# Altium schematic sheet SPE_router_e-fuse_3A.SchDoc: SPE Router
size 420 x 297 mm; Author: P. Daniel; CompanyName: WUT ISE; DrawnBy: P. Daniel; Organization: WUT ISE; Address1: WUT ISE; Address2: Nowowiejska 15/19 00-665 Warsaw; Address3: piotrmaciejdaniel@gmail.com; Revision: 1; SheetNumber: 3; SheetTotal: 6; ModifiedBy: -; CreateDate: 02-03.2023; CheckedDate: -; Title2: e-fuse 3A; DivGrp: WUT ISE; Designer: Piotr Daniel
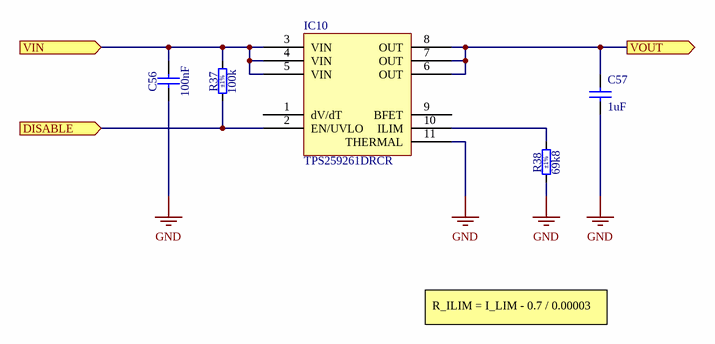
[diagram p0: SPE_router_e-fuse_3A.SchDoc]

## Parts
C56  100nF  [CAPC1005X55N]
C57  1uF  [CAPC1005X55N]
IC10  TPS259261DRCR  [VSON50P300X100_HS-11N]
R37  100k  Tolerance: ±1%  [RESC1005X40N]
R38  69k8  Tolerance: ±1%  [RESC1005X40N]

## Ports
DISABLE (in), VIN (in), VOUT (out)

## Nets
GND: C56.1 C57.1 IC10.11(THERMAL) R38.1
DISABLE: IC10.2(EN/UVLO) R37.1 ; port DISABLE
VIN: C56.2 IC10.3(VIN) IC10.4(VIN) IC10.5(VIN) R37.2 ; port VIN
VOUT: C57.2 IC10.6(OUT) IC10.7(OUT) IC10.8(OUT) ; port VOUT
NetIC10_10: IC10.10(ILIM) R38.2

Not connected (* = marked no-connect by the designer): IC10 1(dV/dT) 9(BFET)

## Notes on the sheet
- R_ILIM = I_LIM - 0.7 / 0.00003
- Project/Equipment
- Document
- Designer
- Drawn by
- Check.by
- Copyright WUT ISE 2021.
  This documentation describes Open Hardware and is licensed under the CERN OHL v.1.1. You may redistribute and modify this documentation under the terms of the CERN OHL v.1.1. (http://ohwr.org/CERNOHL). This documentation is distributed WITHOUT ANY EXPRESS OR IMPLIED WARRANTY, INCLUDING OF MERCHANTABILITY, SATISFACTORY QUALITY AND FITNESS FOR A PARTICULAR PURPOSE. Please see the CERN OHL v.1.1 for applicable conditions.
- Contact
- File
- Last Mod.
- Print Date
- Sheet
- Size
- A3
- of
- Rev

## Library data of the parts
C56 = CC0402_100NF_16V_10%_X7R: Non-polarised capacitor; Part Description: SMD Multilayer Chip Ceramic Capacitor; Manufacturer: GENERIC; Manufacturer1 Part Number: GRM155R71C104KA88D; Voltage: 16V; TC: X7R; Tolerance: ±10%; Part Number: CC0402_100NF_16V_10%_X7R; Component Kind: Standard; Component Type: Standard; Pin Count: 2; Value: 100nF; Status: Not Recommended; Manufacturer Part Number: CC0402_100NF_16V_10%_X7R; Case: 0402; Mounted: Yes; Socket: No; SMD: Yes; Sense: No; Manufacturer1 Example: MURATA; Manufacturer1 ComponentHeight: 0.55mm; HelpURL: \\cern.ch\dfs\Applications\Altium\Datasheets\CC0402_X7R_MURATA_GRM.pdf; Author: CERN DEM JLC; CreateDate: 05.12.2013; LatestRevisionDate: 03.12.2007
C57 = CC0402_1UF_16V_10%_X5R: Non-polarised capacitor; Part Description: SMD Multilayer Chip Ceramic Capacitor; Manufacturer: GENERIC; Manufacturer1 Part Number: C1005X5R1C105KT; Voltage: 16V; TC: X5R; Tolerance: ±10%; Part Number: CC0402_1UF_16V_10%_X5R; Component Kind: Standard; Component Type: Standard; Pin Count: 2; Value: 1uF; Status: Preferred; Manufacturer Part Number: CC0402_1UF_16V_10%_X5R; Case: 0402; Mounted: Yes; Socket: No; SMD: Yes; Sense: No; Manufacturer1 Example: TDK; Manufacturer1 ComponentHeight: 0.55mm; HelpURL: \\cern.ch\dfs\Applications\Altium\Datasheets\CC0402_X5R_TDK_C.pdf; Author: CERN DEM JLC; CreateDate: 25.10.2012; LatestRevisionDate: 25.10.2012
IC10 = TPS259261DRCR: Hot Swap Controller 13.8V Positive Voltage 10-Pin VSON EP T/R; Manufacturer: Texas Instruments; Number of Channels: 1; Min Supply Voltage: 4.5V; Operating Supply Voltage: 12V; Max Output Current: 5A; Operating Supply Current: 470uA; Max Supply Current: 550uA; Supplier 1: Mouser; Manufacturer Part Number: TPS259261DRCR; RoHS: Yes; Category: Power Management ICs; Stock 1: 16119; Pricing 1: 1=1,45000, 10=1,31000, 50=1,25000, 100=1,02000, 1000=0,66500, 10000=0,64300 (USD); Mount: Surface Mount; Number of Pins: 10; Contact Plating: Gold; Min Operating Temperature: -40°C; Max Operating Temperature: 85°C; Max Supply Voltage: 13.8V; Packaging: Tape and Reel; Features: Auto Retry,Thermal Limit,OVP; Lead Free: Lead Free; RoHS Compliant: Yes; ComponentLink1URL: http://www.ti.com/lit/ds/symlink/tps25925.pdf?src-supplier=Digi-Key; ComponentLink1Description: http://www.ti.com/lit/ds/symlink/tps25925.pdf?src-supplier=Digi-Key; ComponentLink2URL: http://www.ti.com/general/docs/suppproductinfo.tsp?distId=10&amp;gotoUrl=http%3A%2F%2Fwww.ti.com%2Flit%2Fgpn%2Ftps25925&src-supplier=Digi-Key; ComponentLink2Description: http://www.ti.com/general/docs/suppproductinfo.tsp?distId=10&amp;gotoUrl=http%3A%2F%2Fwww.ti.com%2Flit%2Fgpn%2Ftps25925&src-supplier=Digi-Key; ComponentLink3URL: http://www.ti.com/lit/gpn/tps25926?src-supplier=Mouser; ComponentLink3Description: http://www.ti.com/lit/gpn/tps25926?src-supplier=Mouser; ComponentLink4URL: http://www.ti.com/general/docs/lit/getliterature.tsp?genericPartNumber=TPS25925&&fileType=pdf&src-supplier=Avnet; ComponentLink4Description: http://www.ti.com/general/docs/lit/getliterature.tsp?genericPartNumber=TPS25925&&fileType=pdf&src-supplier=Avnet; Supplier Part Number 1: 595-TPS259261DRCR
R37 = R0402_100K_1%_0.0625W_100PPM: Resistor - 1%; Part Description: General Purpose Thick Film Chip Resistor; Manufacturer: GENERIC; Manufacturer1 Part Number: 232270671004L; TC: ±100ppm/°C; PressFit: No; Part Number: R0402_100K_1%_0.0625W_100PPM; Component Kind: Standard; Component Type: Standard; Pin Count: 2; Value: 100k; Status: Not Recommended; Power: 0.0625W; Manufacturer Part Number: R0402_100K_1%_0.0625W_100PPM; Case: 0402; Mounted: Yes; Sense: No; Socket: No; SMD: Yes; Manufacturer1 Example: YAGEO PHYCOMP; Manufacturer1 ComponentHeight: 0.4mm; HelpURL: \\cern.ch\dfs\Applications\Altium\Datasheets\R0402_Phycomp_RC0402.pdf; Author: CERN DEM JLC; CreateDate: 03.12.2007; LatestRevisionDate: 17.10.2012
R38 = R0402_69K8_1%_0.063W_100PPM: Resistor - 1%; Part Description: General Purpose Thick Film Chip Resistor; Manufacturer: GENERIC; Manufacturer1 Part Number: CRCW040269K8FK; Power: 0.063W; TC: ±100ppm/°C; PressFit: No; Part Number: R0402_69K8_1%_0.063W_100PPM; Component Kind: Standard; Component Type: Standard; Pin Count: 2; Value: 69k8; Status: None; Manufacturer Part Number: R0402_69K8_1%_0.063W_100PPM; Case: 0402; Mounted: Yes; Sense: No; Socket: No; SMD: Yes; Manufacturer1 Example: VISHAY; Manufacturer1 ComponentHeight: 0.4mm; HelpURL: \\cern.ch\dfs\Applications\Altium\Datasheets\R0402_VISHAY_CRCW e3.pdf; Author: CERN DEM BC; CreateDate: 07.04.2020; LatestRevisionDate: 07.04.2020